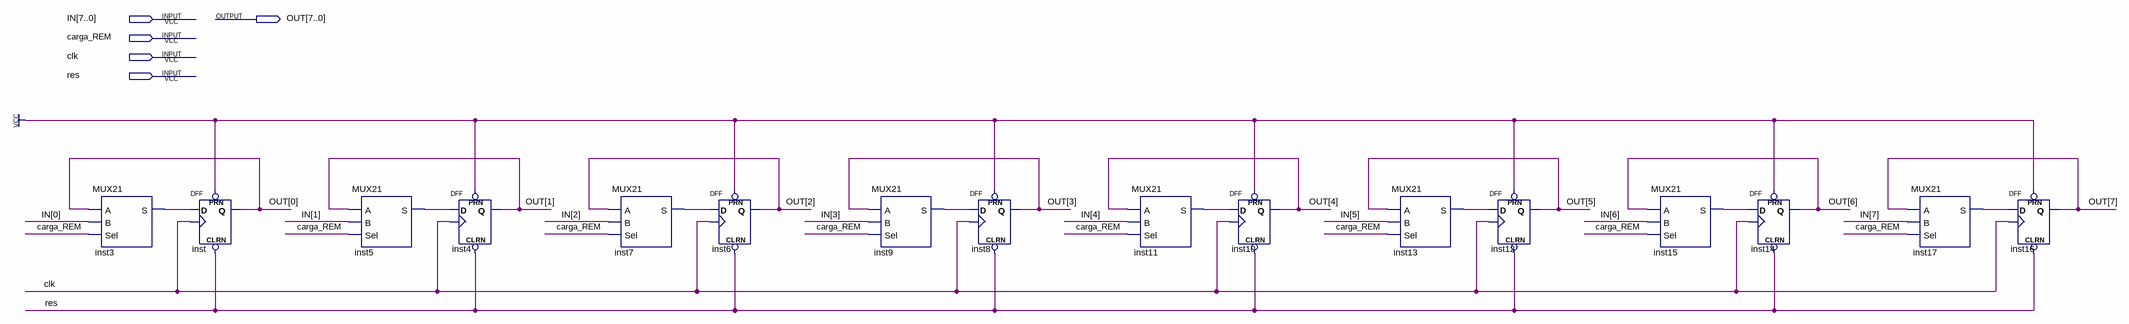
[diagram p0: schematic sheet]
// Quartus schematic REM.bdf as structural Verilog: 16 symbols, 5 pins
module REM (
  input  [7:0] IN,
  input  carga_REM,
  input  clk,
  input  res,
  output [7:0] OUT
);

  wire inst3_s, inst5_s, inst7_s, inst9_s, inst11_s, inst13_s, inst15_s, inst17_s;

  MUX21 inst3 (.A(OUT[0]), .B(IN[0]), .Sel(carga_REM), .S(inst3_s));
  DFF inst (.CLRN(res), .CLK(clk), .D(inst3_s), .PRN(1'b1), .Q(OUT[0]));
  MUX21 inst5 (.A(OUT[1]), .B(IN[1]), .Sel(carga_REM), .S(inst5_s));
  DFF inst4 (.CLRN(res), .CLK(clk), .D(inst5_s), .PRN(1'b1), .Q(OUT[1]));
  MUX21 inst7 (.A(OUT[2]), .B(IN[2]), .Sel(carga_REM), .S(inst7_s));
  DFF inst6 (.CLRN(res), .CLK(clk), .D(inst7_s), .PRN(1'b1), .Q(OUT[2]));
  MUX21 inst9 (.A(OUT[3]), .B(IN[3]), .Sel(carga_REM), .S(inst9_s));
  DFF inst8 (.CLRN(res), .CLK(clk), .D(inst9_s), .PRN(1'b1), .Q(OUT[3]));
  MUX21 inst11 (.A(OUT[4]), .B(IN[4]), .Sel(carga_REM), .S(inst11_s));
  DFF inst10 (.CLRN(res), .CLK(clk), .D(inst11_s), .PRN(1'b1), .Q(OUT[4]));
  MUX21 inst13 (.A(OUT[5]), .B(IN[5]), .Sel(carga_REM), .S(inst13_s));
  DFF inst12 (.CLRN(res), .CLK(clk), .D(inst13_s), .PRN(1'b1), .Q(OUT[5]));
  MUX21 inst15 (.A(OUT[6]), .B(IN[6]), .Sel(carga_REM), .S(inst15_s));
  DFF inst14 (.CLRN(res), .CLK(clk), .D(inst15_s), .PRN(1'b1), .Q(OUT[6]));
  MUX21 inst17 (.A(OUT[7]), .B(IN[7]), .Sel(carga_REM), .S(inst17_s));
  DFF inst16 (.CLRN(res), .CLK(clk), .D(inst17_s), .PRN(1'b1), .Q(OUT[7]));
endmodule
